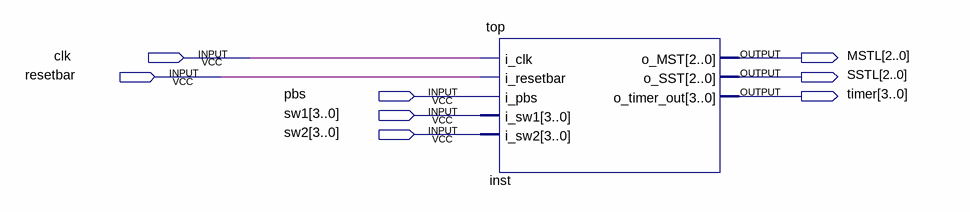
[diagram p0: schematic sheet]
// Quartus schematic lab3.bdf as structural Verilog: 1 symbols, 8 pins
module lab3 (
  input  clk,
  input  resetbar,
  input  pbs,
  input  [3:0] sw1,
  input  [3:0] sw2,
  output [2:0] MSTL,
  output [2:0] SSTL,
  output [3:0] timer
);

  top inst (
    .i_clk(clk), .i_resetbar(resetbar), .i_pbs(pbs), .i_sw1(sw1), .i_sw2(sw2), .o_MST(MSTL), .o_SST(SSTL),
    .o_timer_out(timer));
endmodule
